# EAGLE schematic usb_radio (EAGLE 6.5.0)
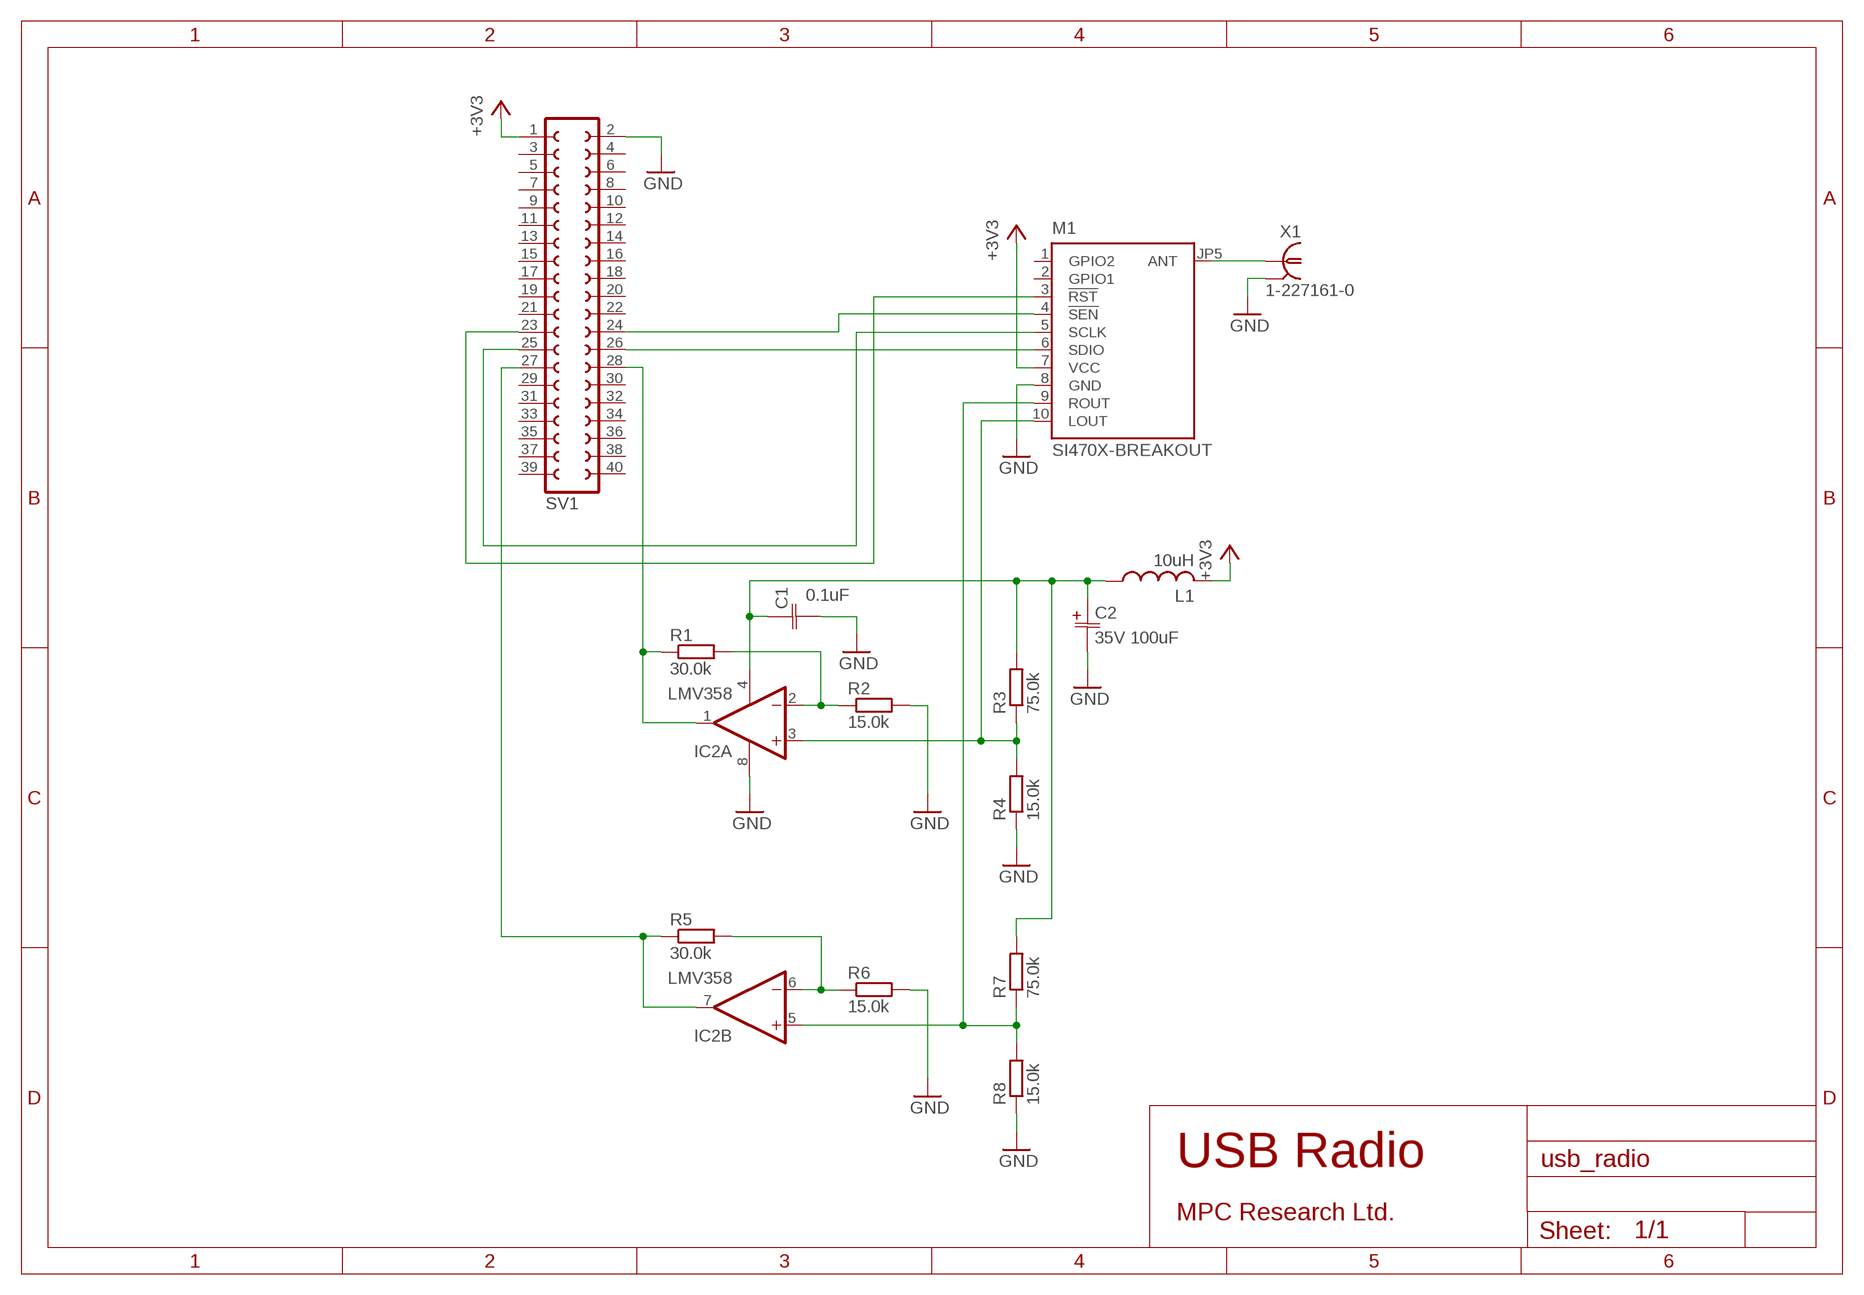
[diagram p0: schematic, sheet 1]

## Parts
C1  0.1uF  C-JIS050-024X044  [C050-024X044]
C2  35V 100uF  CPOL-JIS  [E2,5-5]
IC2  LMV358  LMV358M  [SO08]
L1  10uH  L-US0207/10  [0207/10]
M1  SI470X-BREAKOUT  [SI470X-BREAKOUT]
R1  30.0k  R-EU_0207/10  [0207/10]
R2  15.0k  R-EU_0207/10  [0207/10]
R3  75.0k  R-EU_0207/10  [0207/10]
R4  15.0k  R-EU_0207/10  [0207/10]
R5  30.0k  R-EU_0207/10  [0207/10]
R6  15.0k  R-EU_0207/10  [0207/10]
R7  75.0k  R-EU_0207/10  [0207/10]
R8  15.0k  R-EU_0207/10  [0207/10]
SV1  FE20-2  [FE20-2]
X1  1-227161-0  [AMP_227161]

## Nets
+3V3: L1.2 M1.7(VCC) SV1.1
GND: C1.2 C2.- IC2.8(P:V+) M1.8(GND) R2.2 R4.1 R6.2 R8.1 SV1.2 X1.2
N$1: M1.6(SDIO) SV1.26
N$2: M1.4(!SEN) SV1.24
N$3: M1.5(SCLK) SV1.25
N$4: M1.3(!RST) SV1.23
N$5: M1.JP5(ANT) X1.1
N$6: IC2.3(A:+IN) M1.10(LOUT) R3.1 R4.2
N$7: IC2.2(A:-IN) R1.2 R2.1
N$8: IC2.1(A:OUT) R1.1 SV1.28
N$9: IC2.5(B:+IN) M1.9(ROUT) R7.1 R8.2
N$10: IC2.7(B:OUT) R5.1 SV1.27
N$11: IC2.6(B:-IN) R5.2 R6.1
N$12: C1.1 C2.+ IC2.4(P:V-) L1.1 R3.2 R7.2
Unconnected: M1.1(GPIO2) M1.2(GPIO1) SV1.3 SV1.4 SV1.5 SV1.6 SV1.7 SV1.8 SV1.9 SV1.10 SV1.11 SV1.12 SV1.13 SV1.14 SV1.15 SV1.16 SV1.17 SV1.18 SV1.19 SV1.20 SV1.21 SV1.22 SV1.29 SV1.30 SV1.31 SV1.32 SV1.33 SV1.34 SV1.35 SV1.36 SV1.37 SV1.38 SV1.39 SV1.40

## Notes on the sheet
- USB Radio
- MPC Research Ltd.

## Library data of the parts
C1 = cap:C-JIS: CAPACITOR, Japanese symbol
C2 = cap:CPOL-JIS: POLARIZED CAPACITOR, Japanese symbol
IC2 = linear:LMV358?*: Dual General Purpose, Low Voltage, Rail-to-Rail Output Operational Amplifiers Source: http://www.national.com/mpf/LM/LMV321.html http://www.national.com/dt/lmv_qual.pdf
L1 = resistor:L-US: INDUCTOR, American symbol
M1 = sparkfun:SI470X-BREAKOUT
R1-R8 = resistor:R-EU_: RESISTOR, European symbol
SV1 = con-lsta:FE20-2: FEMALE HEADER; OC_FARNELL: unknown; OC_NEWARK: unknown
X1 = con-coax:?227161*: JACK, RIGHT ANGLE, 50 OHM, PCB, BNC Source: amp_227161.pdf; MF: TYCO ELECTRONICS; MPN: 1-227161; OC_FARNELL: unknown; OC_NEWARK: 33B3200